# EAGLE design Pedal Box Board rev3 (EAGLE 8.1.0)
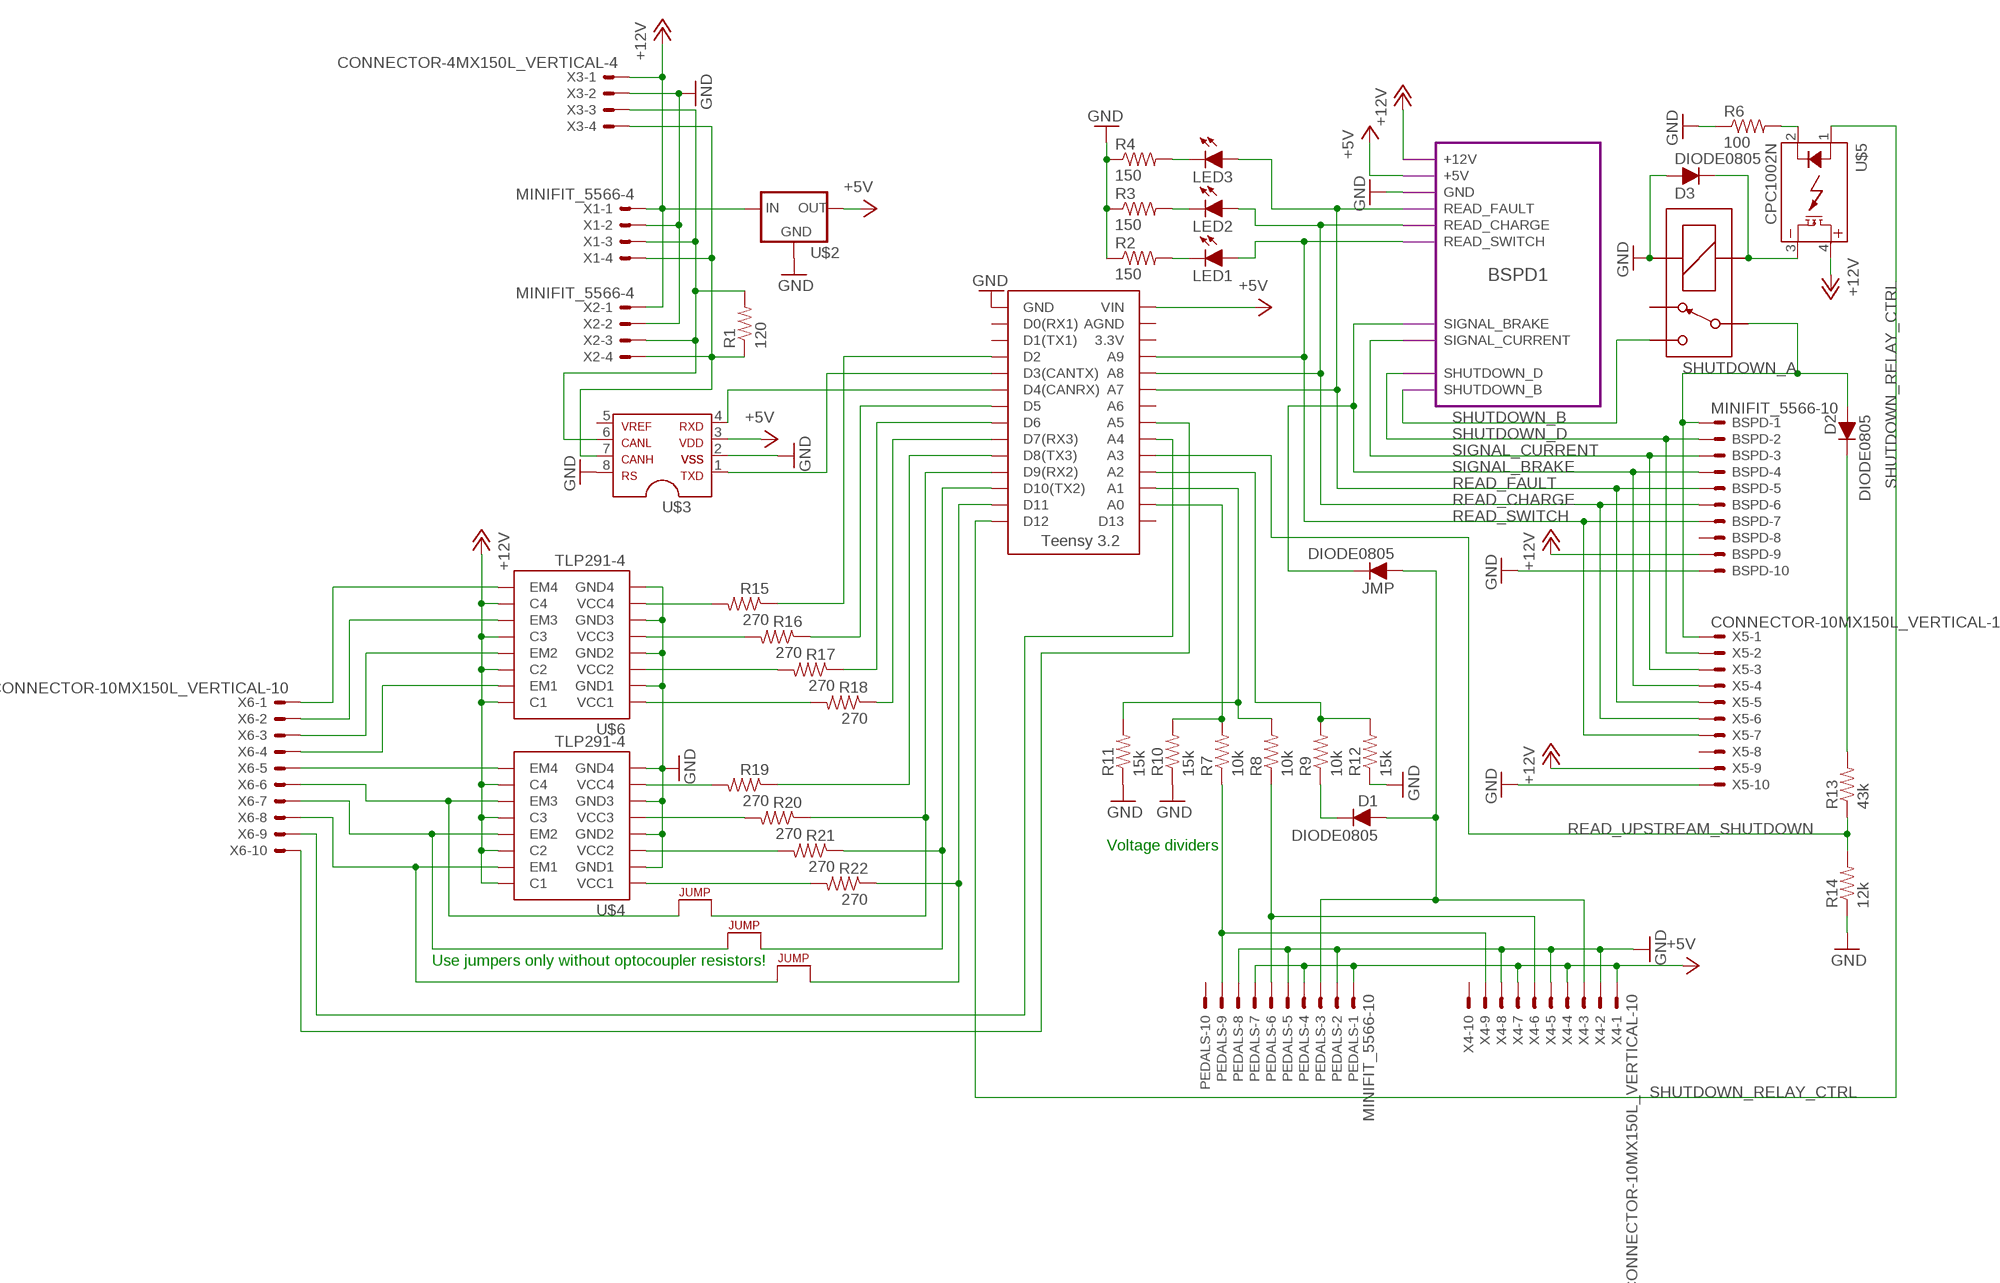
[diagram p0: schematic, sheet 1]

## Parts
BSPD  MINIFIT_5566-10  [MINIFIT_5566-10]
D1  DIODE0805  [0805_D]
D2  DIODE0805  [0805_D]
D3  DIODE0805  [0805_D]
JMP  DIODE0805  [0805_D]
LED1  LED-0805  [LED-805]
LED2  LED-0805  [LED-805]
LED3  LED-0805  [LED-805]
PEDALS  MINIFIT_5566-10  [MINIFIT_5566-10]
R1  120  RESISTOR0805-RES  [0805]
R2  150  RESISTOR0805-RES  [0805]
R3  150  RESISTOR0805-RES  [0805]
R4  150  RESISTOR0805-RES  [0805]
R6  100  RESISTOR0805-RES  [0805]
R7  10k  RESISTOR0805-RES  [0805]
R8  10k  RESISTOR0805-RES  [0805]
R9  10k  RESISTOR0805-RES  [0805]
R10  15k  RESISTOR0805-RES  [0805]
R11  15k  RESISTOR0805-RES  [0805]
R12  15k  RESISTOR0805-RES  [0805]
R13  43k  RESISTOR0805-RES  [0805]
R14  12k  RESISTOR0805-RES  [0805]
R15  270  RESISTOR0805-RES  [0805]
R16  270  RESISTOR0805-RES  [0805]
R17  270  RESISTOR0805-RES  [0805]
R18  270  RESISTOR0805-RES  [0805]
R19  270  RESISTOR0805-RES  [0805]
R20  270  RESISTOR0805-RES  [0805]
R21  270  RESISTOR0805-RES  [0805]
R22  270  RESISTOR0805-RES  [0805]
SOFTWARE_SHUTOFF  G5LE  [ZF112]
U$1  TEENSY_3.2_SIMPLE  [TEENSY_3.2_SIMPLE]
U$2  5VREG_LM340-NLM340MPX-5.0/NOPB  [SOT223]
U$3  MCP2551  [SOIC-08]
U$4  TLP291-4  [SOIC-16]
U$5  CPC1002N  [SOP04]
U$6  TLP291-4  [SOIC-16]
U$7  JUMPER  [0805]
U$8  JUMPER  [0805]
U$9  JUMPER  [0805]
X1  MINIFIT_5566-4  [MINIFIT_5566-4]
X2  MINIFIT_5566-4  [MINIFIT_5566-4]
X3  CONNECTOR-4MX150L_VERTICAL-4  [MX150L_VERTICAL-4]
X4  CONNECTOR-10MX150L_VERTICAL-10  [MX150L_VERTICAL-10]
X5  CONNECTOR-10MX150L_VERTICAL-10  [MX150L_VERTICAL-10]
X6  CONNECTOR-10MX150L_VERTICAL-10  [MX150L_VERTICAL-10]

## Module instances
BSPD1 = BSPD

## Nets
+5V: PEDALS.1 PEDALS.4 PEDALS.7 U$1.VIN U$2.3(OUT) U$3.3 X4.1 X4.4 X4.7 ; port BSPD1.+5V
+12V: BSPD.9 U$2.1(IN) U$4.10(C4) U$4.12(C3) U$4.14(C2) U$4.16(C1) U$5.4(DC+) U$6.10(C4) U$6.12(C3) U$6.14(C2) U$6.16(C1) X1.1 X2.1 X3.1 X5.9 ; port BSPD1.+12V
GND: BSPD.10 D3.A PEDALS.2 PEDALS.5 PEDALS.8 R2.1 R3.1 R4.1 R6.1 R10.1 R11.1 R12.1 R14.1 SOFTWARE_SHUTOFF.1(COIL+) U$1.GND U$2.2(GND) U$2.4(GND) U$3.2 U$3.8 U$4.2(GND1) U$4.4(GND2) U$4.6(GND3) U$4.8(GND4) U$6.2(GND1) U$6.4(GND2) U$6.6(GND3) U$6.8(GND4) X1.2 X2.2 X3.2 X4.2 X4.5 X4.8 X5.10 ; port BSPD1.GND
N$1: PEDALS.9 R7.1 X4.9
N$2: U$1.D4(CANRX) U$3.4
N$3: R1.2 U$3.6 X1.3 X2.3 X3.3
N$4: R1.1 U$3.7 X1.4 X2.4 X3.4
N$5: U$1.D3(CANTX) U$3.1
N$6: R8.2 R11.2 U$1.A1
N$7: D1.C R9.1
N$8: PEDALS.6 R8.1 X4.6
N$9: R7.2 R10.2 U$1.A0
N$10: R9.2 R12.2 U$1.A2
N$11: D1.A JMP.A PEDALS.3 X4.3
N$12: D3.C SOFTWARE_SHUTOFF.2(COIL-) U$5.3(DC-)
N$13: D2.C R13.2
N$14: LED1.C R2.2
N$15: LED2.C R3.2
N$16: LED3.C R4.2
N$17: R21.1 U$1.D10(TX2) U$8.2
N$18: R17.1 U$1.D6
N$19: R15.2 U$6.7(VCC4)
N$20: R15.1 U$1.D2
N$21: R16.1 U$1.D5
N$22: R6.2 U$5.2(CONTROL-)
N$23: R18.1 U$1.D7(RX3)
N$24: R16.2 U$6.5(VCC3)
N$25: R20.1 U$1.D9(RX2) U$7.2
N$26: R22.1 U$1.D11 U$9.2
N$27: R21.2 U$4.3(VCC2)
N$28: R17.2 U$6.3(VCC2)
N$29: R18.2 U$6.1(VCC1)
N$30: R19.1 U$1.D8(TX3)
N$31: R19.2 U$4.7(VCC4)
N$32: R20.2 U$4.5(VCC3)
N$33: U$1.A5 X6.10
N$34: U$1.A4 X6.9
N$35: R22.2 U$4.1(VCC1)
N$36: U$4.13(EM2) U$8.1 X6.7
N$38: U$4.15(EM1) U$9.1 X6.8
N$44: U$6.9(EM4) X6.1
N$45: U$6.11(EM3) X6.2
N$46: U$6.13(EM2) X6.3
N$47: U$6.15(EM1) X6.4
N$48: U$4.9(EM4) X6.5
N$49: U$4.11(EM3) U$7.1 X6.6
READ_CHARGE: BSPD.6 LED2.A U$1.A8 X5.6 ; port BSPD1.READ_CHARGE
READ_FAULT: BSPD.5 LED3.A U$1.A7 X5.5 ; port BSPD1.READ_FAULT
READ_SWITCH: BSPD.7 LED1.A U$1.A9 X5.7 ; port BSPD1.READ_SWITCH
READ_UPSTREAM_SHUTDOWN: R13.1 R14.2 U$1.A3
SHUTDOWN_A: BSPD.1 D2.A SOFTWARE_SHUTOFF.P X5.1
SHUTDOWN_B: SOFTWARE_SHUTOFF.S ; port BSPD1.SHUTDOWN_B
SHUTDOWN_D: BSPD.2 X5.2 ; port BSPD1.SHUTDOWN_D
SHUTDOWN_RELAY_CTRL: U$1.D12 U$5.1(CONTROL+)
SIGNAL_BRAKE: BSPD.4 JMP.C X5.4 ; port BSPD1.SIGNAL_BRAKE
SIGNAL_CURRENT: BSPD.3 X5.3 ; port BSPD1.SIGNAL_CURRENT
Unconnected: BSPD.8 PEDALS.10 SOFTWARE_SHUTOFF.O U$1.3.3V U$1.A6 U$1.AGND U$1.D0(RX1) U$1.D1(TX1) U$1.D13 U$3.5 X4.10 X5.8

## Notes on the sheet
- Voltage dividers
- Use jumpers only without optocoupler resistors!

## Library data of the parts
BSPD PEDALS = HyTechDevices:MINIFIT_5566-10: Mini-Fit Junior connector 10 pole Source: http://www.molex.com; OC_FARNELL: unknown; OC_NEWARK: unknown
D1-D3 JMP = HyTechDevices:DIODE: DIODE general purpose rectifier
LED1-LED3 = HyTechDevices:LED: Light Emitting Diode (LED) Source: Dangerous Prototypes Eagle Library <https://github.com/DangerousPrototypes/Eagle_Part_Library>
R1-R4 R6-R22 = HyTechDevices:RESISTOR: Resistor Basic schematic elements and footprints for 0603, 1206, and PTH resistors.
SOFTWARE_SHUTOFF = HyTechDevices:G5LE: Omron G5LE SPST Relay 5 VDC, 12VDC, 24VDC models Coil voltage: 75% - 170% of nominal voltage Datasheet <https://www.omron.com/ecb/products/pdf/en-g5le.pdf>
U$1 = HyTechDevices:TEENSY_3.2_SIMPLE: Simple version of the Teensy 3.2 board that only uses the 2 main rows of pins, not the inner pins or the pins opposite the usb port.
U$2 = HyTechDevices:5VREG_LM340-N: Voltage Regulator 5v linear voltage regulator Datasheet <http://www.mouser.com/ProductDetail/Texas-Instruments/LM340MPX-50-NOPB/?qs=X1J7HmVL2ZGZwtTFRQ9ItA%3D%3D> MAX current out: 1.5A MAX voltage in: 35V
U$3 = HyTechDevices:MCP2551: MCP2551 High-Speed CAN Transceiver Product Webpage <https://www.microchip.com/wwwproducts/en/MCP2551> Datasheet <http://ww1.microchip.com/downloads/en/DeviceDoc/21667f.pdf> This device is outdated It is replaced by MCP2561. Comparison Page <https://www.microchip.com/wwwproducts/ProductCompare/MCP2551/MCP2561> Product Webpage <https://www.microchip.com/wwwproducts/en/MCP2561> Datasheet <http://ww1.microchip.com/downloads/en/DeviceDoc/20005167C.pdf>
U$4 U$6 = HyTechDevices:TLP291-4: Toshiba Quad Channel Optocoupler TLP291-4
U$5 = HyTechDevices:CPC1002N: IXYS Solid State Relay .7A
U$7-U$9 = HyTechDevices:JUMPER: Jumper for changing operation of a device
X1 X2 = HyTechDevices:MINIFIT_5566-4: Mini-Fit Junior connector 4 pole Source: http://www.molex.com; OC_FARNELL: unknown; OC_NEWARK: unknown
X3 = HyTechDevices:CONNECTOR-4: Mini-Fit Junior connector 4 pole Source: http://www.molex.com
X4-X6 = HyTechDevices:CONNECTOR-10: Mini-Fit Junior connector 10 pole Source: http://www.molex.com

## Module BSPD
Ports: GND(out) +5V(in) READ_CHARGE(out) SHUTDOWN_B(in) READ_SWITCH(out) READ_FAULT(out) SHUTDOWN_D(out) SIGNAL_BRAKE(in) SIGNAL_CURRENT(in) +12V(in)
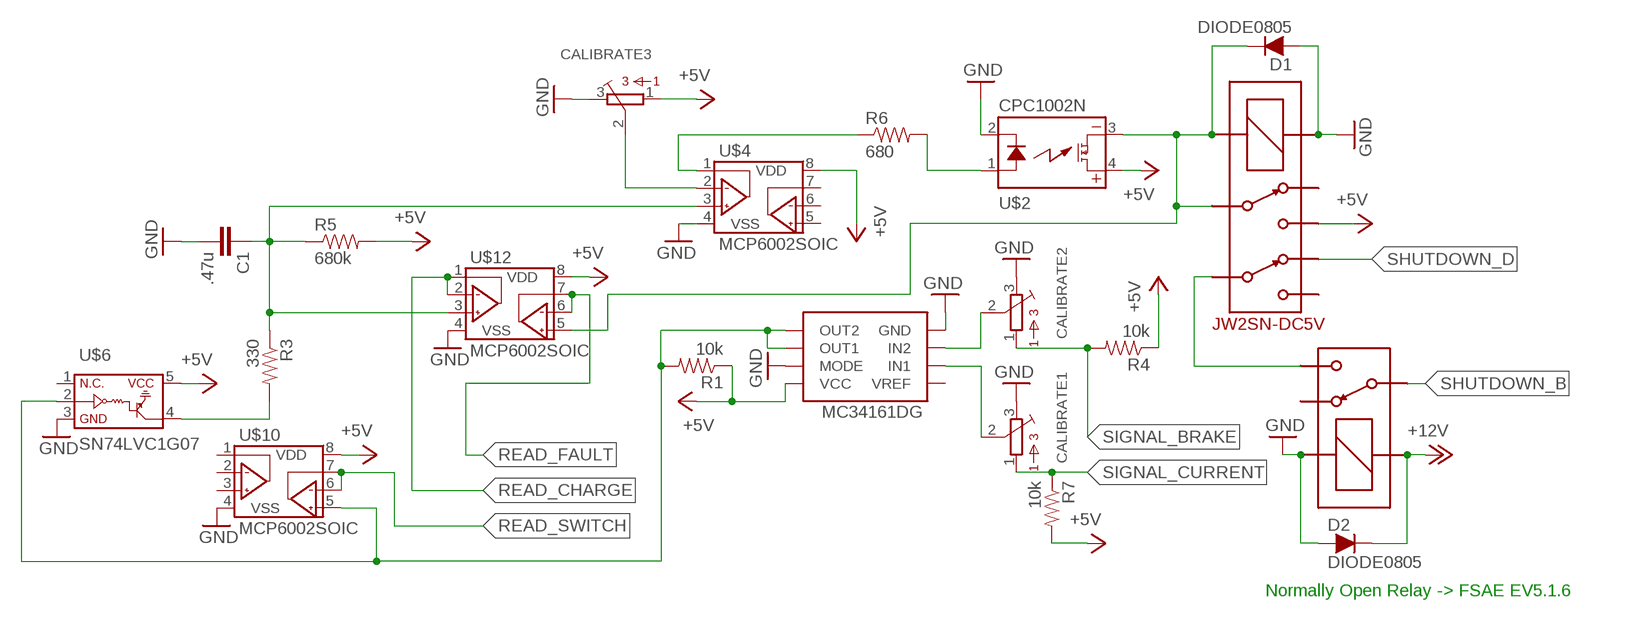
[diagram p1: schematic, module BSPD, sheet 1]

### Parts
C1  .47u  CAPEZ  [CAP-PTH-SMALLEZ]
CALIBRATE1  TRIMPOT_3296C  [TRIMPOT_3296]
CALIBRATE2  TRIMPOT_3296C  [TRIMPOT_3296]
CALIBRATE3  TRIMPOT_3296C  [TRIMPOT_3296]
D1  DIODE0805  [0805_D]
D2  DIODE0805  [0805_D]
MC34161DG  MC34161DG  [SOIC-08]
R1  10k  RESISTOR0805-RES  [0805]
R3  330  RESISTOR0805-RES  [0805]
R4  10k  RESISTOR0805-RES  [0805]
R5  680k  RESISTOREZ  [AXIAL-0.3EZ]
R6  680  RESISTOR0805-RES  [0805]
R7  10k  RESISTOR0805-RES  [0805]
U$1  G5LE  [ZF112]
U$2  CPC1002N  [SOP04]
U$3  JW2SN-DC5V  [JW2SN]
U$4  MCP6002SOIC  [SOIC-08]
U$6  SN74LVC1G07  [SOT-23-5]
U$10  MCP6002SOIC  [SOIC-08]
U$12  MCP6002SOIC  [SOIC-08]

### Nets
+5V: CALIBRATE3.1 MC34161DG.8(VCC) R1.1 R4.1 R5.P$2 R7.2 U$2.4(DC+) U$3.4 U$4.8(VDD) U$6.5 U$10.8(VDD) U$12.8(VDD)
+12V: D2.C U$1.2(COIL-)
GND: C1.2 CALIBRATE1.3 CALIBRATE2.3 CALIBRATE3.3 D1.A D2.A MC34161DG.4(GND) MC34161DG.7(MODE) U$1.1(COIL+) U$2.2(CONTROL-) U$3.COIL+ U$4.4(VSS) U$6.3 U$10.4(VSS) U$12.4(VSS)
N$1: D1.C U$2.3(DC-) U$3.3 U$3.COIL- U$12.5(VINB+)
N$2: R3.2 U$6.4
N$3: R6.2 U$2.1(CONTROL+)
N$5: CALIBRATE2.2 MC34161DG.3(IN2)
N$6: CALIBRATE1.2 MC34161DG.2(IN1)
N$7: CALIBRATE3.2 U$4.2(VINA-)
N$9: R6.1 U$4.1(VOUTA)
N$10: MC34161DG.5(OUT2) MC34161DG.6(OUT1) R1.2 U$6.2 U$10.5(VINB+)
N$13: C1.1 R3.1 R5.P$1 U$4.3(VINA+) U$12.3(VINA+)
READ_CHARGE: U$12.1(VOUTA) U$12.2(VINA-)
READ_FAULT: U$12.6(VINB-) U$12.7(VOUTB)
READ_SWITCH: U$10.6(VINB-) U$10.7(VOUTB)
SHUTDOWN_B: U$1.P
SHUTDOWN_C: U$1.S U$3.6
SHUTDOWN_D: U$3.7
SIGNAL_BRAKE: CALIBRATE2.1 R4.2
SIGNAL_CURRENT: CALIBRATE1.1 R7.1
Unconnected: MC34161DG.1(VREF) U$1.O U$3.2 U$3.5 U$4.5(VINB+) U$4.6(VINB-) U$4.7(VOUTB) U$6.1 U$10.1(VOUTA) U$10.2(VINA-) U$10.3(VINA+)

### Notes on the sheet
- Normally Open Relay -> FSAE EV5.1.6

### Library data of the parts
C1 = HyTechDevices:CAP: Capacitor Standard 0603 ceramic capacitor, and 0.1" leaded capacitor.
CALIBRATE1-CALIBRATE3 = HyTechDevices:TRIMPOT_3296: 3296 Series 3/8" Square Trimmer Source <https://github.com/chiengineer/Eagle-Libraries/blob/master/Potentiometers/bourns.lbr>
D1 D2 = HyTechDevices:DIODE: DIODE general purpose rectifier
MC34161DG = HyTechDevices:MC34161DG: ON Semiconductor MC34161 Dual Channel Voltage Monitor
R1 R3-R7 = HyTechDevices:RESISTOR: Resistor Basic schematic elements and footprints for 0603, 1206, and PTH resistors.
U$1 = HyTechDevices:G5LE: Omron G5LE SPST Relay 5 VDC, 12VDC, 24VDC models Coil voltage: 75% - 170% of nominal voltage Datasheet <https://www.omron.com/ecb/products/pdf/en-g5le.pdf>
U$2 = HyTechDevices:CPC1002N: IXYS Solid State Relay .7A
U$3 = HyTechDevices:JW2SN-DC5V: Panasonic Double Pull Double Throw Relay 5VDC Datasheet <http://www.mouser.com/ds/2/316/jw-catalog-461998.pdf> Product Page <http://www.mouser.com/ProductDetail/Panasonic-Industrial-Devices/JW2SN-DC5V>
U$4 U$10 U$12 = HyTechDevices:MCP6002: Microchip MCP6002 Dual Channel Op Amp
U$6 = HyTechDevices:SN74LVC1G07: TI SN74LVC1G07 Single Buffer/Driver With Open-Drain Output Datasheet <http://www.ti.com/lit/ds/symlink/sn74lvc1g07.pdf>

## Board
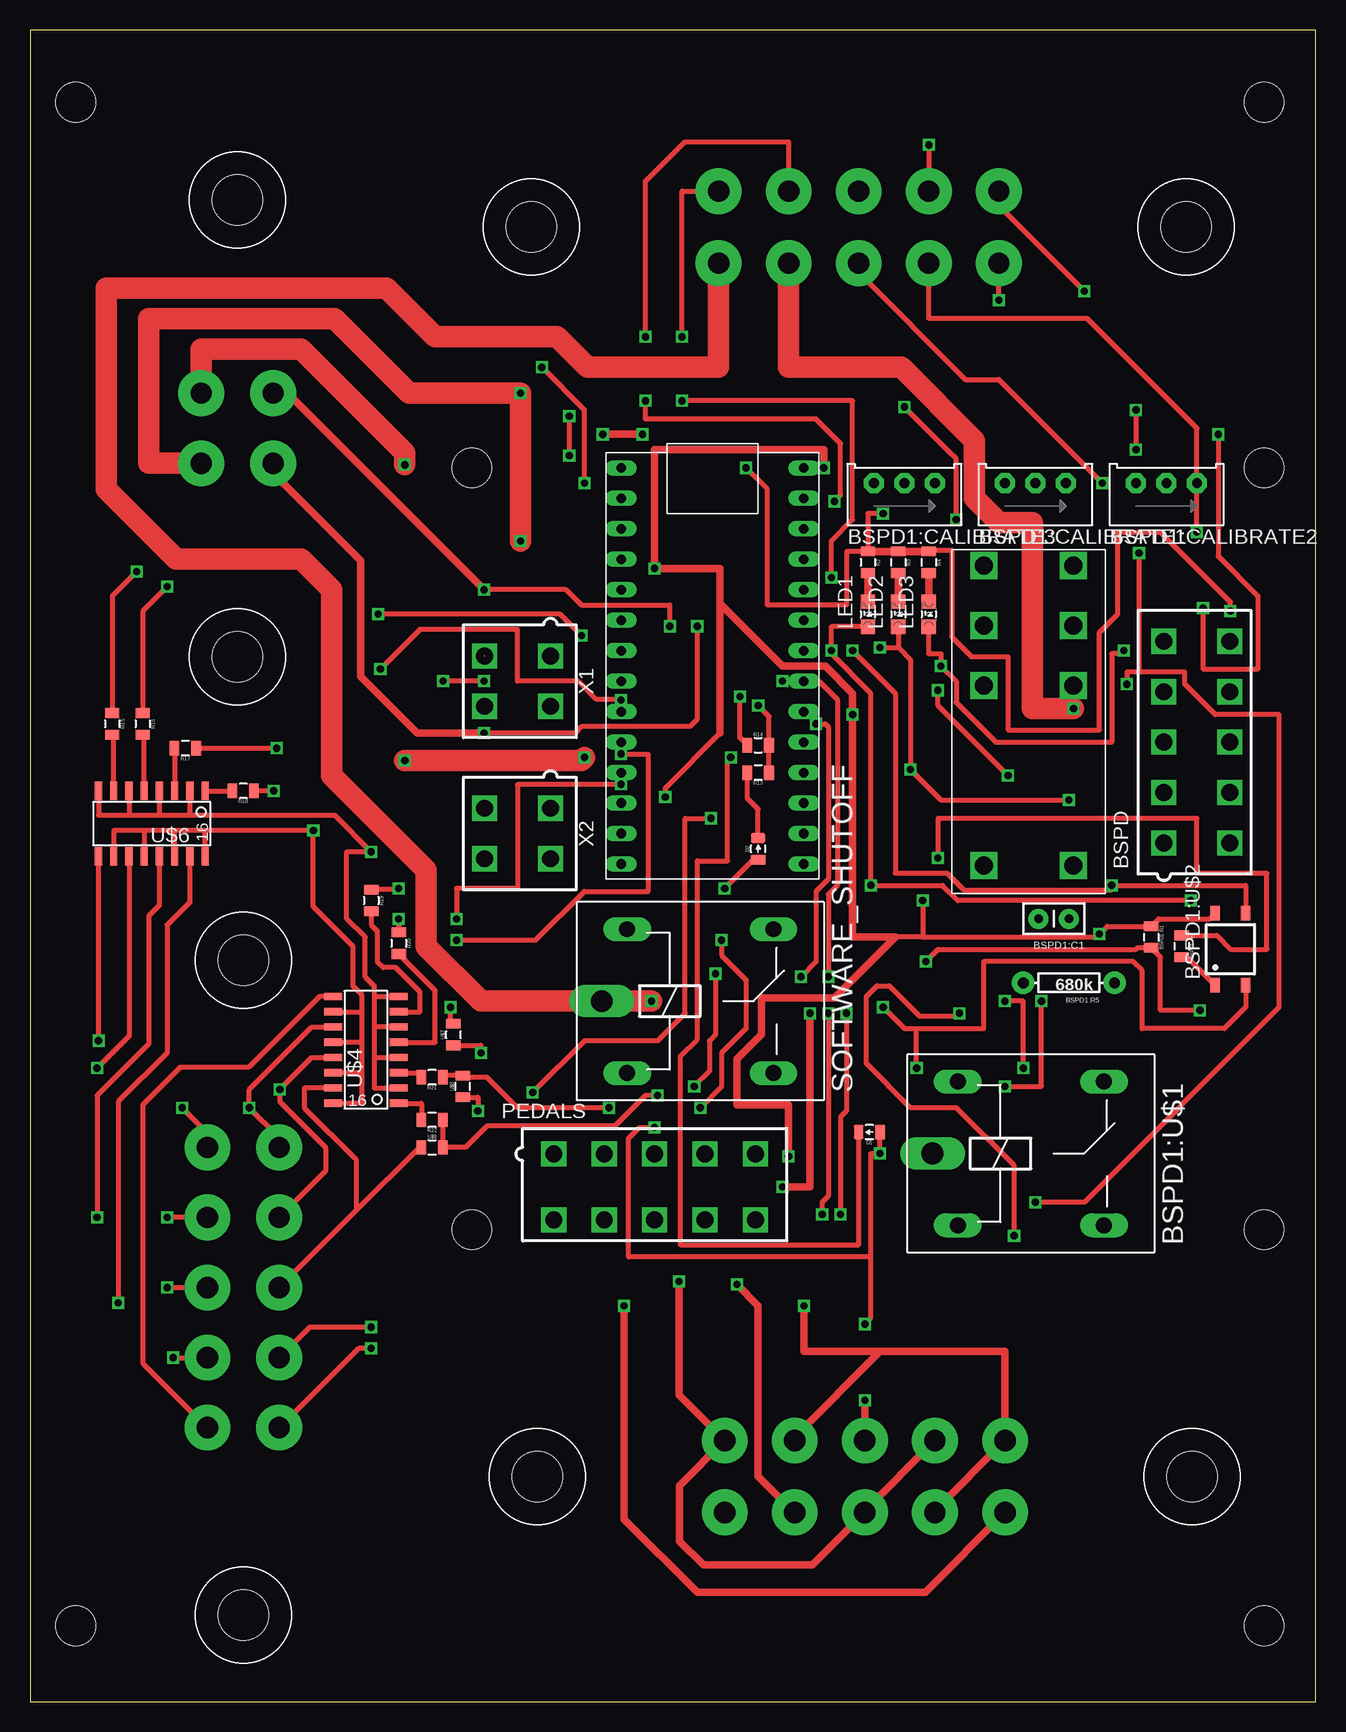
[diagram p2: board, top side]
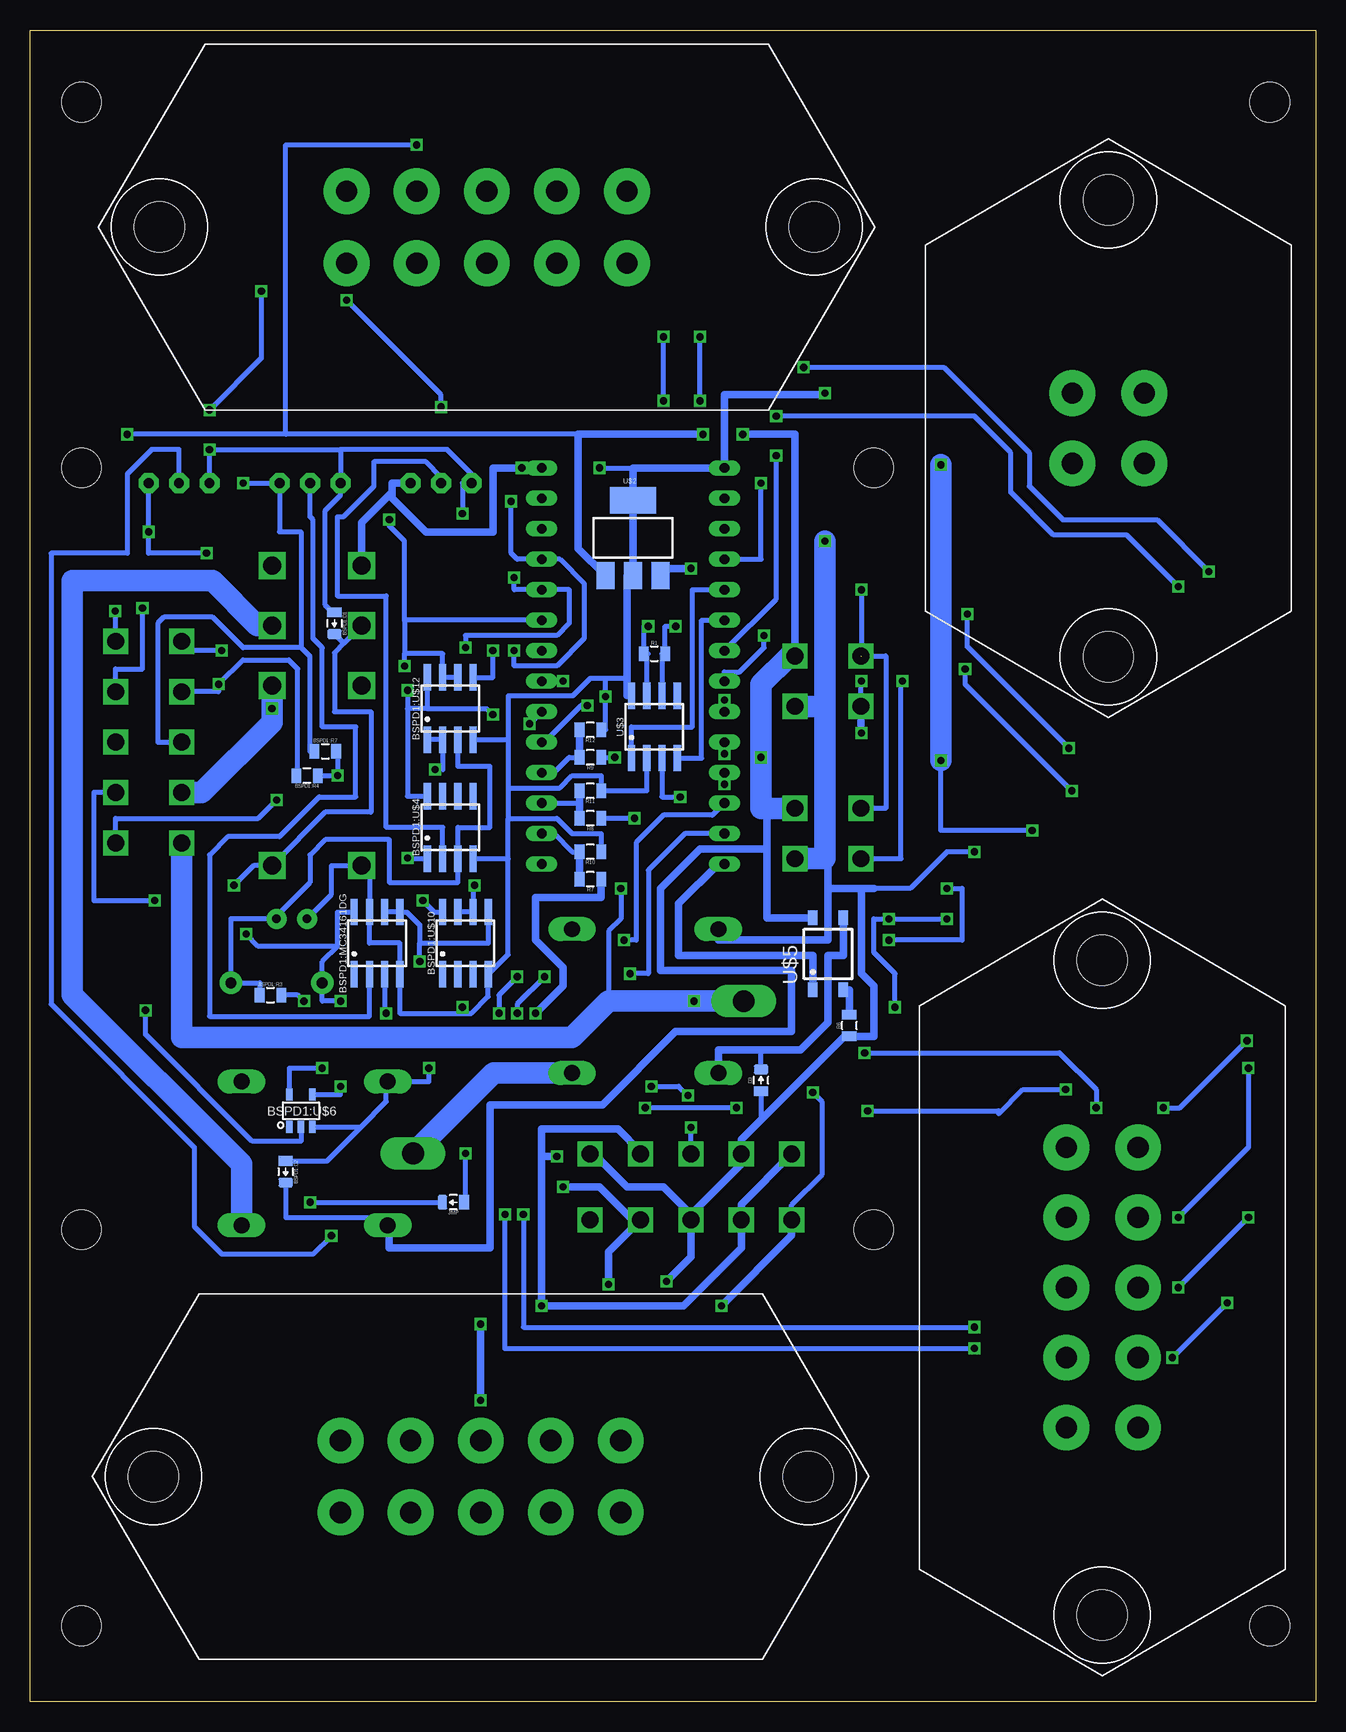
[diagram p3: board, bottom side, seen from below]

Size 107.17 x 139.37 mm. Coordinates in mm from the lower left corner, seen from the top.
Outline: 0,0 107.17,0 107.17,139.37 0,139.37 0,0
Copper layers (1*16): Top 0.035mm / dielectric 1.5mm / Bottom 0.035mm
Design rules "default": minimum track width 10mil, minimum drill 24mil, track to track 8mil, track to pad 8mil, pad to pad 8mil, via to via 8mil, smd to smd 8mil, copper to edge 40mil, drill to drill 8mil, minimum pad ring 10mil, minimum via ring 8mil, stop-mask expansion 4mil, vias tented up to drill 0mil, thermal gap 10mil
Holes 3.3 mm at 36.83,102.87 102.87,102.87 102.87,39.37 36.83,39.37 102.87,133.35 102.87,6.35 3.81,6.35 3.81,133.35

### Footprints (pad centres in the part's own frame; a part is rotated, then mirrored left to right if it is on the bottom)
MINIFIT_5566-10 = drill 1.4 square: 1 8.4,-2.75; 2 4.2,-2.75; 3 0,-2.75; 4 -4.2,-2.75; 5 -8.4,-2.75; 6 8.4,2.75; 7 4.2,2.75; 8 0,2.75; 9 -4.2,2.75; 10 -8.4,2.75
CAP-PTH-SMALLEZ = drill 0.7 pad 1.651: 1 0,0; 2 2.54,0
TRIMPOT_3296 = drill 0.813 pad 1.676 octagon: 1 2.54,1.27; 2 0,1.27; 3 -2.54,1.27
0805_D = smd 0.8 x 1.2: A -0.9,0; C 0.9,0
SOIC-08 = smd 0.6 x 2.2: 1 -1.905,-2.6; 2 -0.635,-2.6; 3 0.635,-2.6; 4 1.905,-2.6; 5 1.905,2.6; 6 0.635,2.6; 7 -0.635,2.6; 8 -1.905,2.6
0805 = smd 0.8 x 1.2: 1 -0.9,0; 2 0.9,0
AXIAL-0.3EZ = drill 0.9 pad 1.88: P$1 -3.81,0; P$2 3.81,0
ZF112 = drill 1.321 long: 1 4.064,14.884; 2 4.064,2.896; O 16.256,14.884; S 16.256,2.896 | drill 1.803 long: P 1.956,8.89
SOP04 = smd 0.8 x 1.2: 1 -1.27,-3; 2 1.27,-3; 3 1.27,3; 4 -1.27,3
JW2SN = drill 1.5 square: 2 10.008,0; 3 5.004,0; 4 0,0; 5 0,7.493; 6 5.004,7.493; 7 10.008,7.493; COIL+ 25.019,0; COIL- 25.019,7.493
SOT-23-5 = smd 1 x 0.55: 1 -1.35,0.95; 2 -1.35,0; 3 -1.35,-0.95; 4 1.35,-0.95; 5 1.35,0.95
LED-805 = smd 1.2 x 1.2: A 0,-1.05; C 0,1.05
TEENSY_3.2_SIMPLE = drill 0.8 long: 3.3V 16.51,29.21; A0 16.51,3.81; A1 16.51,6.35; A2 16.51,8.89; A3 16.51,11.43; A4 16.51,13.97; A5 16.51,16.51; A6 16.51,19.05; A7 16.51,21.59; A8 16.51,24.13; A9 16.51,26.67; AGND 16.51,31.75; D0(RX1) 1.27,31.75; D1(TX1) 1.27,29.21; D2 1.27,26.67; D3(CANTX) 1.27,24.13; D4(CANRX) 1.27,21.59; D5 1.27,19.05; D6 1.27,16.51; D7(RX3) 1.27,13.97; D8(TX3) 1.27,11.43; D9(RX2) 1.27,8.89; D10(TX2) 1.27,6.35; D11 1.27,3.81; D12 1.27,1.27; D13 16.51,1.27; GND 1.27,34.29; VIN 16.51,34.29
SOT223 = smd 1.5 x 2.235: 1 -2.3,-3.15; 2 0,-3.15; 3 2.3,-3.15 | smd 3.8 x 2.2: 4 0,3.15
SOIC-16 = smd 0.61 x 1.524: 1 -4.445,-2.794; 2 -3.175,-2.794; 3 -1.905,-2.794; 4 -0.635,-2.794; 5 0.635,-2.794; 6 1.905,-2.794; 7 3.175,-2.794; 8 4.445,-2.794; 9 4.445,2.667; 10 3.175,2.667; 11 1.905,2.667; 12 0.635,2.667; 13 -0.635,2.667; 14 -1.905,2.667; 15 -3.175,2.667; 16 -4.445,2.667
MINIFIT_5566-4 = drill 1.4 square: 1 2.1,-2.75; 2 -2.1,-2.75; 3 2.1,2.75; 4 -2.1,2.75
MX150L_VERTICAL-4 = drill 1.778 pad 3.81: 1 -2.921,2.997; 2 2.921,2.997; 3 -2.921,-2.997; 4 2.921,-2.997 | hole 4.191: -19.05,0; 19.05,0
MX150L_VERTICAL-10 = drill 1.778 pad 3.81: 1 -11.684,2.997; 2 -5.842,2.997; 3 0,2.997; 4 5.842,2.997; 5 11.684,2.997; 6 -11.684,-2.997; 7 -5.842,-2.997; 8 0,-2.997; 9 5.842,-2.997; 10 11.684,-2.997 | hole 4.191: -27.292,0; 27.292,0

### Placement (x,y rotation side)
BSPD  97.28,80.01 270 top
BSPD1:C1  .47u  [CAP-PTH-SMALLEZ]  86.61,65.28 180 top
BSPD1:CALIBRATE1  [TRIMPOT_3296]  83.82,100.33 0 top
BSPD1:CALIBRATE2  [TRIMPOT_3296]  94.74,100.33 0 top
BSPD1:CALIBRATE3  [TRIMPOT_3296]  72.9,100.33 0 top
BSPD1:D1  DIODE0805  [0805_D]  81.79,89.92 270 bottom
BSPD1:D2  DIODE0805  [0805_D]  85.85,44.2 270 bottom
BSPD1:MC34161DG  [SOIC-08]  78.23,63.25 0 bottom
BSPD1:R1  10k  [0805]  93.47,63.75 270 top
BSPD1:R3  330  [0805]  87.12,58.93 0 bottom
BSPD1:R4  10k  [0805]  84.07,77.22 180 bottom
BSPD1:R5  680k  [AXIAL-0.3EZ]  86.61,59.94 180 top
BSPD1:R6  680  [0805]  96.01,62.99 270 top
BSPD1:R7  10k  [0805]  82.55,79.25 0 bottom
BSPD1:U$1  G5LE  [ZF112]  73.28,36.83 0 top
BSPD1:U$2  CPC1002N  [SOP04]  100.08,62.74 0 top
BSPD1:U$3  JW2SN-DC5V  [JW2SN]  79.5,94.74 270 top
BSPD1:U$4  MCP6002SOIC  [SOIC-08]  72.14,72.9 0 bottom
BSPD1:U$6  SN74LVC1G07  [SOT-23-5]  84.58,49.28 90 bottom
BSPD1:U$10  MCP6002SOIC  [SOIC-08]  70.87,63.25 0 bottom
BSPD1:U$12  MCP6002SOIC  [SOIC-08]  72.14,82.8 0 bottom
D1  69.98,47.5 180 top
D2  60.71,71.12 90 top
D3  46.23,51.82 90 bottom
JMP  71.88,41.66 180 bottom
LED1  69.85,90.68 0 top
LED2  72.39,90.68 0 top
LED3  74.93,90.68 0 top
PEDALS  52.07,42.93 180 top
R1  55.12,87.38 0 bottom
R2  69.85,95 270 top
R3  72.39,95 270 top
R4  74.93,95 270 top
R6  38.86,56.39 90 bottom
R7  60.45,68.58 180 bottom
R8  60.45,73.66 180 bottom
R9  60.45,78.74 180 bottom
R10  60.45,70.87 180 bottom
R11  60.45,75.95 180 bottom
R12  60.45,81.03 180 bottom
R13  60.71,77.47 180 top
R14  60.71,79.76 0 top
R15  6.86,81.53 270 top
R16  9.4,81.53 270 top
R17  12.95,79.5 180 top
R18  17.78,75.95 180 top
R19  28.45,66.8 270 top
R20  30.73,63.25 270 top
R21  33.53,52.07 180 top
R22  33.53,48.51 180 top
SOFTWARE_SHUTOFF  45.72,49.53 0 top
U$1  48.01,68.58 0 top
U$2  56.9,97.03 0 bottom
U$3  55.12,81.28 0 bottom
U$4  27.94,54.36 90 top
U$5  40.64,62.36 0 bottom
U$6  10.16,73.15 180 top
U$7  35.31,55.63 90 top
U$8  36.07,51.31 90 top
U$9  33.53,46.23 0 top
X1  40.64,85.09 90 top
X2  40.64,72.39 90 top
X3  17.27,106.17 270 bottom
X4  69.6,18.8 0 bottom
X5  69.09,122.94 180 bottom
X6  17.78,34.54 270 bottom

### Tracks (layer width: path | path; a pad name or v marks a point on that pad's centre or on a via)
+5V  (via drill 0.6)
  Top 0.406: v52.96,75.44 52.96,76.2 57.53,80.77 | 74.42,63.75 72.14,63.75 | v74.42,66.8 74.42,63.75 | 74.42,63.75 88.9,63.75 v89.15,64.01 89.8,64.65 BSPD1:R1.1 94.1,65.28 98.35,65.28 BSPD1:U$2.4 | v82.8,52.83 82.8,58.42 v81.28,58.42 | v81.53,77.22 75.69,83.06 v75.69,84.33
  Top 0.61: v66.17,102.87 66.17,104.39 52.07,104.39 v52.07,94.49 57.53,94.49 57.53,91.57 | 57.53,91.57 57.53,80.77 | v63.25,45.47 63.25,49.78 58.93,49.78 58.93,53.59 60.96,55.63 60.96,58.67 67.06,58.67 72.14,63.75 68.58,63.75 v68.58,82.3 68.58,84.07 66.29,86.36 62.74,86.36 57.53,91.57 | X4.7 75.44,15.95 X4.1 81.28,29.21 70.87,29.21 | X4.4 63.75,22.1 70.87,29.21 | 70.87,29.21 64.52,29.21 v64.52,33.02
  Bottom 0.406: U$3.3 54.48,75.44 v52.96,75.44 | 81.53,62.99 81.53,65.85 BSPD1:MC34161DG.8 | 81.53,62.99 88.14,62.99 v89.15,64.01 | v74.42,66.8 73.47,65.85 BSPD1:U$10.8 | 74.04,82.8 BSPD1:U$12.8 | 74.04,82.8 75.69,82.8 | 75.69,82.8 75.69,75.5 BSPD1:U$4.8 | 81.53,62.99 82.8,61.72 BSPD1:R5.P$2 82.8,58.42 v81.28,58.42 | BSPD1:R4.1 v81.53,77.22 81.53,79.25 BSPD1:R7.2 | v75.69,84.33 75.69,82.8 | 74.04,82.8 69.09,82.8 v68.58,82.3 | BSPD1:U$6.5 85.53,52.83 v82.8,52.83
  Bottom 0.61: PEDALS.1 47.87,41.48 PEDALS.7 47.87,37.85 52.7,33.02 v64.52,33.02 64.52,45.47 | PEDALS.4 56.27,45.86 58.17,47.75 64.52,47.75 64.52,45.47 | U$2.3 54.6,94.49 v52.07,94.49 | U$1.VIN v66.17,102.87 68.58,102.87 68.58,97.54 74.17,97.54 76.96,100.33 76.96,100.84 | 64.52,45.47 v63.25,45.47 | 76.96,100.84 76.96,101.6 BSPD1:CALIBRATE3.1 | BSPD1:U$3.4 79.5,98.3 76.96,100.84
+12V  (via drill 0.6)
  Top 0.406: v97.79,91.19 97.79,86.11 102.36,86.11 102.36,92.2 99.06,95.5 v99.06,105.66 | v74.93,129.79 X5.9 | U$6.16 14.61,72.64 | U$6.14 12.06,72.64 | 14.61,72.64 12.06,72.64 | 12.06,72.64 9.53,72.64 | 9.53,72.64 U$6.12 | 9.53,72.64 6.99,72.64 U$6.10 | 14.61,72.64 v23.62,72.64 23.62,66.29 26.92,62.99 26.92,59.69 27.69,58.93 27.69,57.53 | 27.69,54.99 U$4.12 | U$4.10 27.69,57.53 | 27.69,54.99 27.69,57.53 | 27.69,52.45 U$4.14 | 27.69,52.45 27.69,54.99 | U$4.16 27.69,49.91 27.69,52.45
  Top 0.61: v51.05,105.66 v47.75,105.66
  Top 1.778: v46.23,78.74 45.97,78.49 v31.24,78.49 | X3.1 14.28,112.78 22.61,112.78 31.24,104.14 v31.24,103.12
  Bottom 0.406: BSPD.9 100.03,86.11 97.79,86.11 v97.79,91.19 | BSPD1:D2.C 85.85,40.39 77.34,40.39 BSPD1:U$1.2 | 61.47,105.66 85.85,105.66 | 85.85,105.66 v99.06,105.66 | 85.85,105.66 85.85,129.79 v74.93,129.79 | v23.62,72.64 31.24,72.64 v31.24,78.49
  Bottom 0.61: U$5.4 45.72,65.36 45.72,71.12 | v51.05,105.66 61.47,105.66 61.47,96.15 U$2.1 | BSPD1:U$1.2 77.22,39.73 77.22,37.85 68.83,37.85 68.83,49.78 59.44,49.78 53.34,55.88 43.69,55.88 43.69,60.96 54.61,60.96 54.61,67.82 51.31,71.12 45.72,71.12 | 45.72,71.12 45.72,74.49 45.85,74.49 | v47.75,105.66 43.39,105.66 X1.1
  Bottom 1.778: X2.1 45.85,74.49 46.23,74.49 v46.23,78.74 46.23,84.84 43.87,87.19 X1.1 | v31.24,78.49 v31.24,103.12
BSPD1:N$1  (via drill 0.6)
  Top 0.406: BSPD1:U$2.3 101.35,68.07 v90.17,68.07 90.17,67.69 77.85,67.69 76.45,69.09 72.14,69.09 72.14,84.07 v68.58,87.63
  Bottom 0.406: 80.94,88.3 81.79,87.45 81.79,82.55 78.74,82.55 78.74,74.17 82.55,74.17 BSPD1:U$3.COIL- 88.52,69.72 v90.17,68.07 | 80.94,88.3 BSPD1:U$3.3 | BSPD1:U$12.5 68.58,85.4 v68.58,87.63 | BSPD1:D1.C 81.08,88.3 80.94,88.3
BSPD1:N$2  (via drill 0.6)
  Top 0.406: v81.28,51.31 84.33,51.31 v84.33,58.42
  Bottom 0.406: v84.33,58.42 84.84,58.93 BSPD1:R3.2 | BSPD1:U$6.4 81.28,50.63 v81.28,51.31
BSPD1:N$3
  Top 0.406: BSPD1:R6.2 96.45,62.09 BSPD1:U$2.1
BSPD1:N$5  (via drill 0.6)
  Top 0.406: v77.47,57.4 77.47,57.15 74.17,57.15 71.63,59.69 70.61,59.69 69.72,58.8 69.72,53.21 73.41,49.53 77.22,49.53 82.04,44.7 v82.04,38.86
  Bottom 0.406: BSPD1:MC34161DG.3 77.6,57.4 v77.47,57.4 | BSPD1:CALIBRATE2.2 94.74,104.39 97.03,104.39 99.06,102.36 99.06,95.76 105.41,95.76 105.41,58.17 93.47,46.23 93.47,39.62 91.19,37.34 83.57,37.34 v82.04,38.86
BSPD1:N$6
  Bottom 0.406: BSPD1:MC34161DG.2 78.87,57.15 92.2,57.15 92.2,70.61 90.68,72.14 86.36,72.14 83.06,75.44 80.01,75.44 80.01,81.28 82.8,81.28 82.8,87.88 83.57,88.65 83.57,98.55 83.82,98.81 BSPD1:CALIBRATE1.2
BSPD1:N$7
  Bottom 0.406: BSPD1:U$4.2 72.77,72.9 77.47,72.9 77.47,92.2 81.53,92.2 81.53,98.81 81.03,98.81 78.49,101.35 78.49,103.38 74.17,103.38 72.9,102.11 BSPD1:CALIBRATE3.2
BSPD1:N$9  (via drill 0.6)
  Top 0.406: v75.69,70.36 75.69,73.66 97.28,73.66 97.28,69.09 103.12,69.09 103.12,62.74 100.08,62.74 98.92,63.89 BSPD1:R6.1
  Bottom 0.406: v75.69,70.36 75.69,70.3 BSPD1:U$4.1
BSPD1:N$10  (via drill 0.6)
  Top 0.406: v97.54,57.66 94.23,57.66 94.23,62.09 BSPD1:R1.2 92.32,62.85 92.2,62.74 75.69,62.74 v74.68,61.72
  Bottom 0.406: BSPD1:U$10.5 68.96,63.25 74.68,63.25 | BSPD1:MC34161DG.6 BSPD1:MC34161DG.5 75.75,65.85 74.68,64.77 74.68,63.25 | v74.68,61.72 74.68,63.25 | v97.54,57.66 97.54,55.63 88.65,46.74 84.58,46.74 BSPD1:U$6.2
BSPD1:N$13
  Bottom 0.406: BSPD1:R3.1 88.02,59.94 BSPD1:R5.P$1 90.42,65.28 BSPD1:C1.1 86.61,65.53 83.82,68.33 83.82,70.61 82.55,71.88 77.22,71.88 77.22,68.33 71.5,68.33 BSPD1:U$4.3 71.5,72.9 68.83,72.9 68.83,77.98 71.5,77.98 BSPD1:U$12.3
BSPD1:SHUTDOWN_C
  Bottom 1.778: BSPD1:U$3.6 88.21,89.74 91.95,93.47 103.63,93.47 103.63,58.93 89.53,44.83 BSPD1:U$1.S
GND  (via drill 0.6)
  Top 0.406: v100.08,90.93 100.08,91.69 94.23,97.54 90.68,97.54 90.68,90.68 89.15,89.15 89.15,81.03 81.53,81.03 81.53,87.12 78.49,87.12 76.83,88.77 76.83,96.01 75.05,96.01 R4.1 | BSPD1:U$2.2 101.35,57.91 99.57,56.13 92.71,56.13 92.71,60.96 91.95,61.72 79.5,61.72 79.5,56.13 73.91,56.13 | v71.12,57.91 72.9,56.13 73.91,56.13 | v71.12,99.06 69.85,99.06 R2.1 68.07,95.9 68.07,91.44 61.47,91.44 61.47,101.09 v59.69,102.87 | v73.91,52.83 73.91,56.13 | R14.1 59.18,80.38 v59.18,83.82 | X5.10 80.77,124.71 v87.88,117.6 | v92.2,107.7 v92.2,104.39 | U$6.8 5.71,73.91 8.26,73.91 | U$6.6 8.26,73.91 | 8.26,73.91 10.79,73.91 | 10.79,73.91 U$6.4 | 10.79,73.91 13.34,73.91 | 13.34,73.91 U$6.2 | 13.34,73.91 25.4,73.91 v28.45,70.87 26.42,70.87 26.42,65.28 27.94,63.75 27.94,60.45 28.7,59.69 28.7,58.8 | 28.7,58.8 U$4.8 | U$4.6 28.7,56.26 | 28.7,58.8 28.7,56.26 | 28.7,56.26 28.7,53.72 | 28.7,53.72 U$4.4 | 28.7,53.72 28.7,51.18 U$4.2
  Top 0.61: R2.1 R3.1 R4.1 | X4.2 69.6,15.95 X4.8 65.23,11.43 56.13,11.43 54.15,13.41 54.15,18.03 X4.5 54.1,25.6 v54.1,35.05
  Top 1.778: v40.89,96.77 v40.89,109.09 31.62,109.09 25.4,115.32 9.91,115.32 9.91,103.25 X3.2
  Bottom 0.406: R12.1 59.18,81.03 v59.18,83.82 59.18,85.34 | 67.31,80.2 67.31,76.2 | 67.31,76.2 62.99,76.2 61.98,77.22 59.55,77.22 R11.1 55.75,75.95 U$3.2 | 67.31,76.2 67.31,73.66 | 67.31,73.66 63.25,73.66 61.98,72.39 59.55,72.39 R10.1 | v59.69,102.87 56.9,102.87 | 81.28,104.39 v92.2,104.39 BSPD1:CALIBRATE2.3 | 81.28,104.39 BSPD1:CALIBRATE1.3 81.28,100.58 82.55,99.31 82.55,91.44 81.93,90.82 BSPD1:D1.A | 81.28,104.39 72.39,104.39 70.36,102.36 BSPD1:CALIBRATE3.3 71.12,101.6 v71.12,99.06 | BSPD.10 100.03,90.93 v100.08,90.93 | 67.31,70.3 67.31,73.66 | BSPD1:C1.2 82.04,67.31 82.04,69.72 BSPD1:U$3.COIL+ 78.87,69.72 BSPD1:MC34161DG.7 78.87,63.25 76.33,63.25 BSPD1:MC34161DG.4 76.33,57.4 70.61,57.4 | BSPD1:U$12.4 67.31,80.2 | BSPD1:U$4.4 67.31,70.3 | 70.61,57.4 70.36,57.4 68.96,58.8 BSPD1:U$10.4 67.31,62.3 67.31,70.3 | 70.61,57.4 v71.12,57.91 | v73.91,52.83 73.91,51.71 BSPD1:U$1.1 77.47,51.59 77.47,50.04 79.58,47.93 | 67.31,80.2 67.31,83.88 61.92,83.88 60.45,85.34 59.18,85.34 | 59.18,85.34 57.66,85.34 57.4,85.09 | BSPD1:U$6.3 79.58,47.93 | D3.A 46.23,48.51 | BSPD1:D2.A 82.41,45.1 79.58,47.93 | v87.88,117.6 87.88,112.01 v92.2,107.7 | 36.83,67.82 33.78,67.82 30.73,70.87 v28.45,70.87
  Bottom 0.61: 52.07,40.64 47.87,44.84 PEDALS.2 47.87,46.87 46.23,48.51 39.25,55.49 R6.1 36.83,55.49 36.83,59.69 37.85,60.71 37.85,67.82 | 52.07,40.64 PEDALS.8 52.07,37.08 v54.1,35.05 | 52.07,40.64 54.36,42.93 57.4,42.93 60.15,45.68 PEDALS.5 | SOFTWARE_SHUTOFF.1 49.78,63.5 40.64,63.5 40.64,67.82 | U$3.8 57.4,83.88 57.4,85.09 57.4,93.88 U$2.2 U$2.4 56.9,102.87 U$1.GND 49.28,108.97 40.89,108.97 v40.89,109.09 | 40.89,70.29 40.64,70.29 40.64,67.82 | 37.85,67.82 36.83,67.82 | 37.85,67.82 40.64,67.82 | 41.27,96.77 v40.89,96.77
  Bottom 1.778: 40.89,82.99 40.89,70.29 X2.2 | X1.2 40.89,82.99 | v40.89,96.77 40.89,82.99
N$1  (via drill 0.6)
  Top 0.61: v62.74,42.93 65.02,42.93 v65.02,57.4 | v58.93,34.8 60.71,33.02 60.71,18.8 63.7,15.8 X4.9
  Bottom 0.61: v62.74,42.93 59.69,42.93 56.94,40.18 PEDALS.9 58.93,37.52 v58.93,34.8 | R7.1 59.55,67.06 65.02,67.06 65.02,63.5 62.74,61.21 62.74,59.69 v65.02,57.4
N$2
  Bottom 0.406: U$3.4 51.18,78.68 51.18,90.17 U$1.D4(CANRX)
N$3  (via drill 0.6)  (1 unrouted)
  Top 0.406: v53.34,89.66 53.34,91.44 45.97,91.44 44.7,92.71 v37.85,92.71
  Top 0.61: X3.3 21.46,109.09 v37.85,92.71
  Bottom 0.406: U$3.6 54.48,87.38 R1.2 54.22,89.66 v53.34,89.66 | v37.85,92.71 37.85,87.19 | X1.3 35.81,87.19 35.81,74.49 X2.3
N$4  (via drill 0.6)
  Top 0.406: v55.63,89.66 55.63,81.92 55.05,81.34 46.04,81.34 45.47,80.77 v37.85,80.77 | v37.85,85.09 v34.44,85.09
  Top 0.61: v37.85,80.77 32.26,80.77 27.56,85.47 27.56,95.12 20.27,102.41 X3.4
  Bottom 0.406: 55.75,87.38 U$3.7 | 55.63,87.38 55.75,87.38 | 55.75,87.38 R1.1 56.02,89.65 v55.63,89.66 | X2.4 34.54,70.29 34.54,85.09 v34.44,85.09 | X1.4 37.89,85.09 v37.85,85.09
  Bottom 0.61: v37.85,80.77 37.89,80.82 X1.4
N$5
  Bottom 0.406: U$3.1 57.02,81.28 51.94,81.28 51.94,92.71 U$1.D3(CANTX)
N$6
  Bottom 0.406: U$1.A1 61.35,74.93
  Bottom 0.61: R11.2 61.35,74.93 R8.2
N$7  (via drill 0.6)
  Top 0.406: D1.C 69.09,38.1 54.23,38.1 54.23,53.85 55.63,55.24 55.63,70.1 58.17,70.1 58.17,78.74 v58.42,78.74
  Bottom 0.406: R9.1 v58.42,78.74
N$8  (via drill 0.6)
  Top 0.406: v56.77,73.66 54.61,73.66 54.61,57.4 52.32,55.12 46.23,55.12 v41.91,50.8
  Top 0.61: X4.6 74.62,9.14 55.63,9.14 49.53,15.24 v49.53,33.02
  Bottom 0.406: v56.77,73.66 R8.1 | PEDALS.6 43.67,41.42 41.15,43.94 41.15,50.04 v41.91,50.8
  Bottom 0.61: v49.53,33.02 43.67,38.88 PEDALS.6
N$9
  Bottom 0.406: U$1.A0 63.5,72.39 61.98,70.87 R10.2
  Bottom 0.61: R10.2 R7.2
N$10
  Bottom 0.406: U$1.A2 63.5,77.47 62.23,78.74 R9.2
  Bottom 0.61: R12.2 R9.2
N$11  (via drill 0.6)
  Top 0.406: v52.07,47.88 50.8,47.88 49.91,46.99 49.91,37.08 70.1,37.08 | 70.1,37.08 70.1,45.72 v70.87,45.72 70.87,47.5 D1.A | v69.6,31.5 70.1,32 70.1,37.08
  Top 0.61: v69.6,25.15 X4.3
  Bottom 0.406: PEDALS.3 v52.07,47.88 | JMP.A 70.87,41.66 v70.87,45.72
  Bottom 0.61: v69.6,31.5 v69.6,25.15
N$12
  Bottom 0.406: D3.C 46.23,54.36
  Bottom 0.61: SOFTWARE_SHUTOFF.2 49.78,54.36 46.23,54.36 42.93,54.36 40.64,56.64 40.64,62.23 39.37,62.23 U$5.3
N$13
  Top 0.406: D2.C 60.71,74.42 59.81,75.32 R13.2
N$14
  Top 0.61: R2.2 LED1.C
N$15
  Top 0.61: LED2.C R3.2
N$16
  Top 0.61: LED3.C R4.2
N$17  (via drill 0.6)
  Top 0.406: R21.1 34.43,52.21 U$8.2 36.21,52.07 38.1,52.07 40.64,49.53 v48.26,49.53 | v57.66,63.5 57.66,62.23 59.69,60.2 59.69,56.13 57.66,54.1 57.66,51.31 v55.88,49.53
  Bottom 0.406: U$1.D10(TX2) 50.29,73.91 54.36,73.91 56.64,71.63 56.64,63.5 v57.66,63.5 | v48.26,49.53 v55.88,49.53
N$18  (via drill 0.6)
  Top 0.406: v45.97,88.9 44.2,90.68 v29.03,90.68 | R17.1 v20.57,79.5
  Bottom 0.406: U$1.D6 49.28,85.85 48.01,85.85 45.97,87.88 v45.97,88.9 | v20.57,79.5 29.03,87.96 v29.03,90.68
N$19
  Top 0.406: R15.2 6.99,80.63 U$6.7
N$20  (via drill 0.6)
  Top 0.406: 8.77,94.12 v8.89,94.23 6.86,92.2 R15.1 | v46.23,101.6 46.23,107.7 v42.67,111.25
  Bottom 0.406: U$1.D2 46.23,95.25 v46.23,101.6 | v42.67,111.25 30.99,111.25 23.88,104.14 23.88,101.35 21.08,98.55 13.21,98.55 v8.89,94.23
N$21  (via drill 0.6)
  Top 0.406: 11.31,92.85 v11.43,92.96 9.4,90.93 R16.1 | v44.96,107.19 v44.96,103.89
  Bottom 0.406: U$1.D5 44.96,91.95 v44.96,103.89 | v11.43,92.96 15.75,97.28 21.84,97.28 25.4,100.84 25.4,104.14 28.45,107.19 v44.96,107.19
N$22
  Bottom 0.61: R6.2 38.86,59.36 U$5.2
N$23  (via drill 0.6)
  Top 0.406: v49.28,83.52 49.23,83.57 47.24,83.57 45.72,85.09 40.64,85.09 40.64,89.41 32.51,89.41 v29.21,86.11 | v20.32,75.95 R18.1
  Bottom 0.406: U$1.D7(RX3) v49.28,83.52 49.28,83.57 | v29.21,86.11 29.21,84.84 v20.32,75.95
N$24
  Top 0.406: R16.2 9.53,80.63 U$6.5
N$25  (via drill 0.6)
  Top 0.406: v49.28,76.5 49.23,76.45 40.64,76.45 40.64,67.82 35.56,67.82 v35.56,65.28 | v30.73,65.28 R20.1 | U$7.2 35.05,56.78 v35.05,57.91
  Bottom 0.406: U$1.D9(RX2) v49.28,76.5 | v30.73,65.28 v35.56,65.28 36.83,65.28 36.83,62.48 35.05,60.71 v35.05,57.91
N$26  (via drill 0.6)
  Top 0.406: R22.1 U$9.2 36.32,46.23 38.1,48.01 48.77,48.01 51.31,50.55 v52.32,50.55 | v57.15,60.71 57.15,55.63 56.64,55.12 56.64,52.58 v55.37,51.31
  Bottom 0.406: U$1.D11 52.58,72.39 55.63,69.34 55.63,60.71 v57.15,60.71 | v55.37,51.31 53.09,51.31 v52.32,50.55
N$27
  Top 0.406: U$4.3 32.63,52.45 R21.2
N$28
  Top 0.406: R17.2 12.06,79.49 U$6.3
N$29
  Top 0.406: U$6.1 R18.2
N$30  (via drill 0.6)
  Top 0.406: v35.56,63.5 42.16,63.5 46.23,67.56 51.56,67.56 51.56,78.99 49.28,78.99 v49.28,79.04 | R19.1 28.95,67.73 30.73,67.73 v30.73,67.82
  Bottom 0.406: U$1.D8(TX3) v49.28,79.04 49.28,78.99 | v30.73,67.82 29.46,67.82 29.46,63.5 v35.56,63.5
N$31
  Top 0.406: U$4.7 32.51,57.53 32.51,59.18 30.48,61.21 29.46,61.21 28.96,61.72 28.96,64.26 28.45,64.77 R19.2
N$32
  Top 0.406: R20.2 33.78,59.3 33.78,54.99 U$4.5
N$33  (via drill 0.6)
  Top 0.406: v62.74,85.09 65.79,85.09 67.31,83.57 67.31,68.07 66.55,67.31 v66.55,60.45 | v68.07,57.4 68.07,49.28 67.56,48.77 v67.56,40.64 | v28.45,29.46 27.38,29.46 X6.10
  Bottom 0.406: U$1.A5 v62.74,85.09 | v66.55,60.45 68.07,58.93 v68.07,57.4 | v67.56,40.64 67.56,29.46 v28.45,29.46
N$34  (via drill 0.6)
  Top 0.406: v65.53,81.53 66.29,81.53 66.55,81.28 66.55,68.58 65.53,67.56 65.53,61.72 v64.26,60.45 | v66.04,40.64 66.04,41.66 66.55,42.16 v66.55,57.4 | v28.45,31.24 23.32,31.24 X6.9
  Bottom 0.406: U$1.A4 v65.53,81.53 | v64.26,60.45 66.55,58.17 v66.55,57.4 | v66.04,40.64 66.04,31.24 v28.45,31.24
N$35
  Top 0.406: R22.2 32.63,49.91 U$4.1
N$36  (via drill 0.6)
  Top 0.406: U$4.13 23.5,53.72 v20.83,51.05 20.83,50.04 24.64,46.23 24.64,44.25 X6.7 | U$8.1 37.34,50.41 v37.34,49.28
  Bottom 0.406: v20.83,51.05 24.38,51.05 26.42,49.02 26.42,49.28 v37.34,49.28
N$38
  Top 0.406: U$4.15 22.86,51.18 22.86,49.53 27.18,45.21 27.18,40.95 27.15,40.92 | U$9.1 32.46,46.23 27.15,40.92 | 27.15,40.92 X6.8
N$44  (via drill 0.6)
  Top 0.406: v5.71,55.12 U$6.9 | X6.1 14.78,47.45 v12.7,49.53
  Bottom 0.406: v12.7,49.53 11.3,49.53 v5.71,55.12
N$45  (via drill 0.6)
  Top 0.406: U$6.11 8.26,55.5 v5.59,52.83 | X6.2 v11.43,40.39
  Bottom 0.406: v5.59,52.83 5.59,46.23 v11.43,40.39
N$46  (via drill 0.6)
  Top 0.406: U$6.13 10.79,66.42 9.91,65.53 9.91,54.86 5.59,50.55 v5.59,40.39 | v11.43,34.54 X6.3
  Bottom 0.406: v5.59,40.39 v11.43,34.54
N$47  (via drill 0.6)
  Top 0.406: U$6.15 13.34,66.67 11.43,64.77 11.43,54.1 7.37,50.04 v7.37,33.27 | v11.94,28.7 X6.4
  Bottom 0.406: v7.37,33.27 v11.94,28.7
N$48
  Top 0.406: U$4.9 24.13,58.8 18.22,52.9 12.51,52.9 9.4,49.78 9.4,28.25 X6.5
N$49  (via drill 0.6)
  Top 0.406: U$4.11 23.5,56.26 18.29,51.05 v18.29,49.53 20.78,47.04 X6.6 | U$7.1 37.59,54.73 v37.59,54.1
  Bottom 0.406: v37.59,54.1 21.34,54.1 18.29,51.05 v18.29,49.53
READ_CHARGE  (via drill 0.6)
  Top 0.406: LED2.A 72.39,87.88 | v70.87,87.88 72.39,87.88 | v86.61,75.18 75.95,75.18 v73.41,77.72 73.41,86.87 72.39,87.88 | v54.36,108.46 68.58,108.46 68.58,98.55 66.8,96.77 v66.8,93.73 | v54.36,113.79 54.36,125.93 X5.6
  Bottom 0.406: BSPD1:U$12.1 BSPD1:U$12.2 72.77,77.72 v73.41,77.72 | BSPD.6 100.03,73.66 88.14,73.66 v86.61,75.18 | v70.87,87.88 70.87,88.9 63.25,88.9 62.23,89.92 62.23,92.71 U$1.A8 66.8,92.71 v66.8,93.73 | v54.36,108.46 v54.36,113.79
READ_FAULT  (via drill 0.6)
  Top 0.406: LED3.A 74.93,87.38 75.95,87.38 v75.95,86.36 77.22,85.09 77.22,83.31 80.52,80.01 90.17,80.01 90.17,87.38 90.93,87.38 v91.19,87.63 | 76.71,104.14 76.96,103.89 | 76.71,104.14 v72.9,107.95 | v80.77,116.84 X5.5 | v77.22,98.55 77.22,103.63 76.71,104.14
  Bottom 0.406: U$1.A7 75.95,90.17 | 75.95,90.17 75.95,87.38 | BSPD1:U$12.6 BSPD1:U$12.7 72.77,87.38 75.95,87.38 | v75.95,86.36 75.95,87.38 | v91.19,87.63 93.75,87.63 BSPD.5 | 75.95,90.17 75.95,96.77 77.22,98.04 v77.22,98.55 | v72.9,107.95 72.9,108.97 v80.77,116.84
READ_SWITCH  (via drill 0.6)
  Top 0.406: v96.77,66.8 77.34,66.8 76.07,68.07 v70.1,68.07 70.1,84.07 66.8,87.38 v66.8,87.63 66.8,89.63 LED1.A | v67.06,100.08 67.56,100.58 67.56,104.9 65.53,106.93 51.31,106.93 v51.31,108.46 | v51.31,113.79 51.31,126.75 54.61,130.05 63.25,130.05 X5.7
  Bottom 0.406: BSPD1:U$10.7 BSPD1:U$10.6 70.23,68.07 v70.1,68.07 | BSPD.7 101.85,75.81 101.85,66.8 v96.77,66.8 | v67.06,100.08 67.06,95.76 66.55,95.25 U$1.A9 62.99,95.25 60.96,93.22 60.96,88.65 63.25,86.36 66.8,86.36 v66.8,87.63 | v51.31,108.46 v51.31,113.79
READ_UPSTREAM_SHUTDOWN  (via drill 0.6)
  Top 0.406: R13.1 R14.2 61.61,82.16 v60.71,83.06
  Bottom 0.406: U$1.A3 64.26,80.01 61.21,83.06 v60.71,83.06
SHUTDOWN_A  (via drill 0.6)
  Top 0.406: D2.A 60.31,70.22 v57.91,67.82
  Top 1.778: X5.1 57.4,111.25 46.48,111.25 43.94,113.79 33.78,113.79 29.72,117.86 6.35,117.86 6.35,101.09 12.19,95.25 22.61,95.25 25.15,92.71 25.15,77.22 33.02,69.34 33.02,62.99 37.59,58.42 v51.82,58.42
  Bottom 0.406: v57.91,67.82 57.91,65.28 58.93,64.26 58.93,58.42
  Bottom 1.778: BSPD.1 94.53,55.37 61.98,55.37 58.93,58.42 v51.82,58.42 SOFTWARE_SHUTOFF.P
SHUTDOWN_B
  Bottom 1.778: BSPD1:U$1.P 68.53,52.43 SOFTWARE_SHUTOFF.S
SHUTDOWN_D  (via drill 0.6)
  Top 1.778: v87,82.8 83.57,82.8 83.57,98.3 80.77,98.3 78.74,100.33 78.74,105.16 72.64,111.25 63.25,111.25 X5.2
  Bottom 1.778: BSPD.2 92.85,75.81 87,81.66 v87,82.8 BSPD1:U$3.7
SHUTDOWN_RELAY_CTRL
  Bottom 0.61: U$5.1 41.91,62.23 53.09,62.23 53.09,66.55 49.78,69.85 U$1.D12
SIGNAL_BRAKE  (via drill 0.6)
  Top 0.406: v91.44,84.84 91.44,85.85 92.46,85.85 | 92.46,85.85 96.27,85.85 96.27,84.84 98.81,82.3 104.14,82.3 104.14,57.91 87.88,41.66 v83.82,41.66 | v92.46,95.76 92.46,85.85 | v97.28,97.54 97.28,106.17 88.14,115.32 74.93,115.32 X5.4
  Bottom 0.406: BSPD.4 91.44,84.21 v91.44,84.84 89.41,86.87 85.6,86.87 84.84,86.11 84.84,77.22 BSPD1:R4.2 | v92.46,95.76 97.28,95.76 v97.28,97.54 BSPD1:CALIBRATE2.1 | v83.82,41.66 JMP.C
SIGNAL_CURRENT  (via drill 0.6)
  Top 0.406: X5.3 69.09,119.13 77.98,110.24 80.77,110.24 v89.41,101.6
  Bottom 0.406: 84.58,87.88 84.58,97.54 86.36,97.54 BSPD1:CALIBRATE1.1 v89.41,101.6 | BSPD.3 96.52,80.01 96.52,89.92 96.01,90.42 91.95,90.42 89.41,87.88 84.58,87.88 | BSPD1:R7.1 83.82,79.25 83.82,87.12 84.58,87.88

### Text on the board
tDocu: SW | CH | FAULT | HyTech 2017 Pedal Box Board rev3